# Altium project Sp25-Candle_Maker.PrjPcb (part 2 of 2)

## Sheet POWER_SHEET.SchDoc
size 381 x 241 mm; SheetNumber: 10; SheetTotal: 12
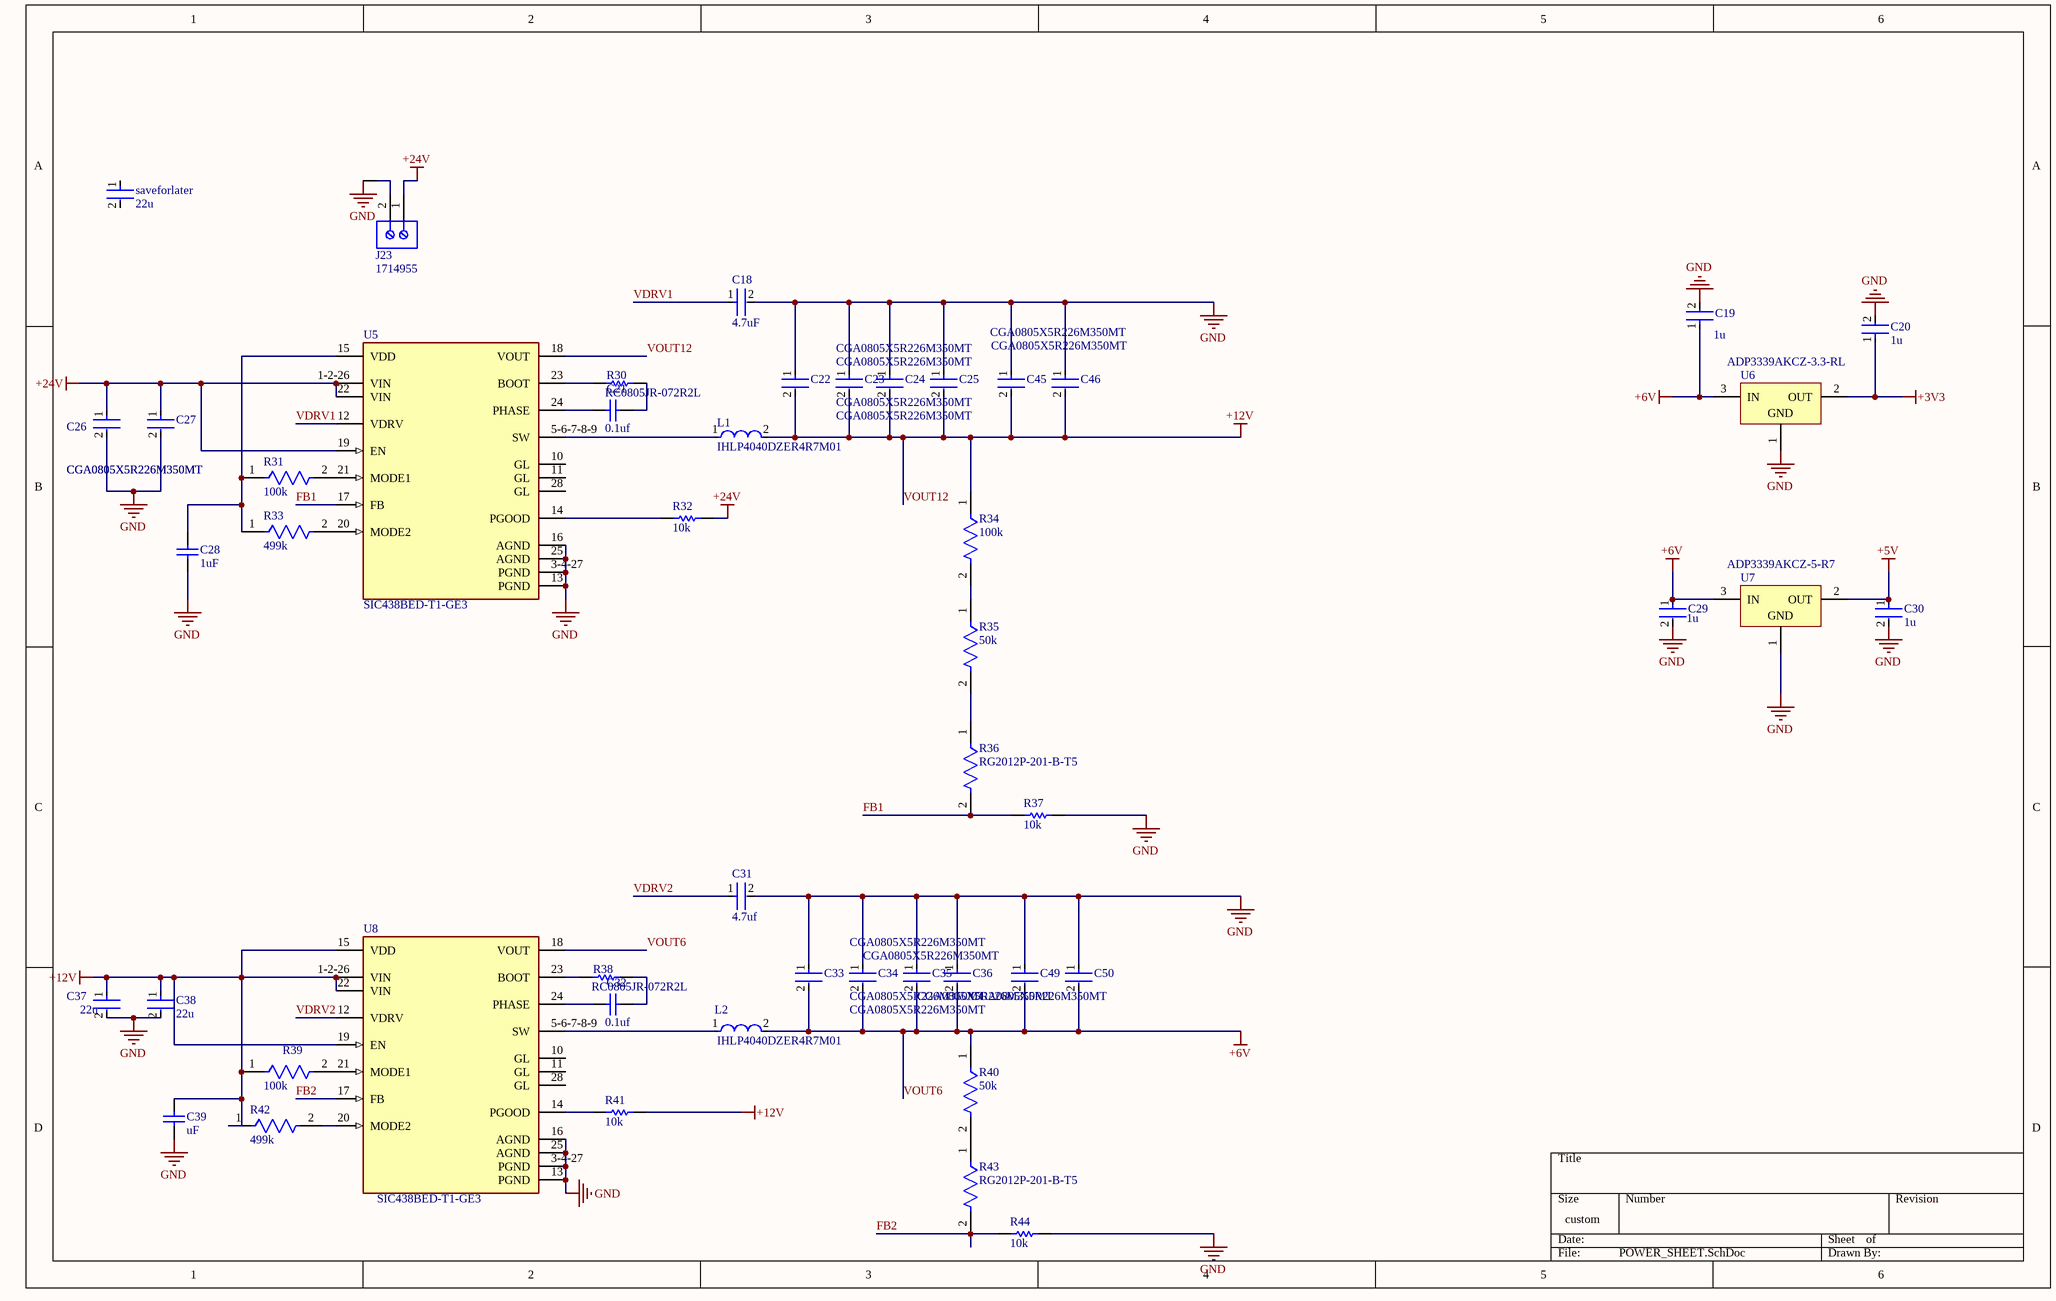
[diagram p6: POWER_SHEET.SchDoc]

### Parts
C18  4.7uF  [FP-CL21-IPC_A]
C19  1u  [FP-CL21-IPC_A]
C20  1u  [FP-CL21-IPC_A]
C21  0.1uf  [CAPC2013X94X50LL20T25]
C22  CGA0805X5R226M350MT  [FP-GRM21B-0_2-e0_2_0_7-IPC_A]
C23  CGA0805X5R226M350MT  [FP-GRM21B-0_2-e0_2_0_7-IPC_A]
C24  CGA0805X5R226M350MT  [FP-GRM21B-0_2-e0_2_0_7-IPC_A]
C25  CGA0805X5R226M350MT  [FP-GRM21B-0_2-e0_2_0_7-IPC_A]
C26  CGA0805X5R226M350MT  [FP-GRM21B-0_2-e0_2_0_7-IPC_A]
C27  CGA0805X5R226M350MT  [FP-GRM21B-0_2-e0_2_0_7-IPC_A]
C28  1uF  [CAPC2013X94X50ML25T25]
C29  1u  [FP-CL21-IPC_A]
C30  1u  [FP-CL21-IPC_A]
C31  4.7uf  [FP-CL21-IPC_A]
C32  0.1uf  [CAPC2013X94X50LL20T25]
C33  CGA0805X5R226M350MT  [FP-GRM21B-0_2-e0_2_0_7-IPC_A]
C34  CGA0805X5R226M350MT  [FP-GRM21B-0_2-e0_2_0_7-IPC_A]
C35  CGA0805X5R226M350MT  [FP-GRM21B-0_2-e0_2_0_7-IPC_A]
C36  CGA0805X5R226M350MT  [FP-GRM21B-0_2-e0_2_0_7-IPC_A]
C37  22u  [FP-CL21-IPC_C]
C38  22u  [FP-CL21-IPC_C]
C39  uF  [CAPC2013X94X50ML25T25]
C45  CGA0805X5R226M350MT  [FP-GRM21B-0_2-e0_2_0_7-IPC_A]
C46  CGA0805X5R226M350MT  [FP-GRM21B-0_2-e0_2_0_7-IPC_A]
C49  CGA0805X5R226M350MT  [FP-GRM21B-0_2-e0_2_0_7-IPC_A]
C50  CGA0805X5R226M350MT  [FP-GRM21B-0_2-e0_2_0_7-IPC_A]
J23  1714955  [PHOE-1714955_V]
L1  IHLP4040DZER4R7M01  [FP-IHLP-4040DZ-FP_3_124x3-MFG]
L2  IHLP4040DZER4R7M01  [FP-IHLP-4040DZ-FP_3_124x3-MFG]
R30  RC0805JR-072R2L  [RESC2013X60X35LL10T20]
R31  100k  [FP-ESR10-MFG]
R32  10k  [RESC2013X60X40LL20T25_A]
R33  499k  [FP-RT0805-MFG]
R34  100k  [FP-ESR10-MFG]
R35  50k  [FP-PNM0805-MFG]
R36  RG2012P-201-B-T5  [FP-RG2012-IPC_A]
R37  10k  [RESC2013X60X40LL20T25_A]
R38  RC0805JR-072R2L  [RESC2013X60X35LL10T20]
R39  100k  [FP-ESR10-MFG]
R40  50k  [FP-PNM0805-MFG]
R41  10k  [RESC2013X60X40LL20T25_A]
R42  499k  [FP-RT0805-MFG]
R43  RG2012P-201-B-T5  [FP-RG2012-IPC_A]
R44  10k  [RESC2013X60X40LL20T25_A]
saveforlater  22u  [FP-CL21-IPC_C]
U5  SIC438BED-T1-GE3  [FP-T22-0442-MFG]
U6  ADP3339AKCZ-3.3-RL  [ADI-KC-3_N]
U7  ADP3339AKCZ-5-R7  [ADI-KC-3_N]
U8  SIC438BED-T1-GE3  [FP-T22-0442-MFG]

### Nets
+3V3: C20.1 U6.2(OUT)
+5V: C30.1 U7.2(OUT)
+24V: C26.1 C27.1 J23.1 R32.2 U5.1-2-26(VIN) U5.19(EN) U5.22(VIN)
GND: C18.2 C19.2 C20.2 C22.1 C23.1 C24.1 C25.1 C26.2 C27.2 C28.1 C29.2 C30.2 C31.2 C33.1 C34.1 C35.1 C36.1 C37.2 C38.2 C39.1 C45.1 C46.1 C49.1 C50.1 J23.2 R37.2 R44.2 U5.3-4-27(PGND) U5.13(PGND) U5.16(AGND) U5.25(AGND) U6.1(GND) U7.1(GND) U8.3-4-27(PGND) U8.13(PGND) U8.16(AGND) U8.25(AGND)
VOUT6: C19.1 C29.1 C33.2 C34.2 C35.2 C36.2 C49.2 C50.2 L2.2 R40.1 U6.3(IN) U7.3(IN) U8.18(VOUT)  [also labelled +6V]
VOUT12: C22.2 C23.2 C24.2 C25.2 C37.1 C38.1 C39.2 C45.2 C46.2 L1.2 R34.1 R39.1 R41.2 R42.1 U5.18(VOUT) U8.1-2-26(VIN) U8.15(VDD) U8.19(EN) U8.22(VIN)  [also labelled +12V]
FB1: R36.2 R37.1 U5.17(FB)
FB2: R43.2 R44.1 U8.17(FB)
VDRV1: C18.1 U5.12(VDRV)
VDRV2: C31.1 U8.12(VDRV)
NetC21_1: C21.1 U5.24(PHASE)
NetC21_2: C21.2 R30.2
NetC28_2: C28.2 R31.1 R33.1 U5.15(VDD)
NetC32_1: C32.1 U8.24(PHASE)
NetC32_2: C32.2 R38.2
NetL1_1: L1.1 U5.5-6-7-8-9(SW)
NetL2_1: L2.1 U8.5-6-7-8-9(SW)
NetR30_1: R30.1 U5.23(BOOT)
NetR31_2: R31.2 U5.21(MODE1)
NetR32_1: R32.1 U5.14(PGOOD)
NetR33_2: R33.2 U5.20(MODE2)
NetR34_2: R34.2 R35.1
NetR35_2: R35.2 R36.1
NetR38_1: R38.1 U8.23(BOOT)
NetR39_2: R39.2 U8.21(MODE1)
NetR40_2: R40.2 R43.1
NetR41_1: R41.1 U8.14(PGOOD)
NetR42_2: R42.2 U8.20(MODE2)

Not connected (* = marked no-connect by the designer): saveforlater 1 2; U5 10(GL) 11(GL) 28(GL); U8 10(GL) 11(GL) 28(GL)

### Library data of the parts
C18 C31 = CMP-13271-002624-1: CL21 Series 0805 4.7uF 25V ±10% Tolerance X5R Multilayer Ceramic Chip Capacitor; Case Code (Imperial): 0805; Thickness: 0.055inch; Mount: Surface Mount; Case Code (Metric): 2012; Capacitance: 4.7uF; Depth: 1.25mm; Lead Free: Lead Free; Case/Package: 0805; Voltage Rating: 25V; Package Quantity: 1; Width: 0.049inch; Radiation Hardening: No; Voltage Rating (DC): 25V; Length: 2mm; Dielectric: X5R; Height: 1.25mm; Packaging: Tape and Reel; Tolerance: 10%; Min Operating Temperature: -55°C; Max Operating Temperature: 85°C
C19 C20 C29 C30 = CMP-13271-003098-1: CL21 Series 0805 1uF 16V ±10% Tolerance X7R Multilayer Ceramic Chip Capacitor; Case Code (Metric): 2012; Width: 0.049inch; Thickness: 0.053inch; Voltage Rating: 16V; Max Operating Temperature: 125°C; Case Code (Imperial): 0805; Height: 1.25mm; Length: 2mm; Case/Package: 0805; Lead Free: Lead Free; Mount: Surface Mount; Capacitance: 1uF; Tolerance: 10%; Voltage Rating (DC): 16V; Min Operating Temperature: -55°C; Contact Plating: Tin; Depth: 1.25mm; Packaging: Tape and Reel; Package Quantity: 1; Voltage: 16V; Dielectric: X7R; Radiation Hardening: No
C21 C32 = CMP-2007-04344-1: Manufacturer: AVX Interconnect / Elco; Part Number: 08055A6R0CAT2A
C22-C27 C33-C36 C45 C46 C49 C50 = CMP-2000-07599-2: Chip Multilayer Ceramic Capacitors for General Purpose, 0805, 100uF, X5R, 15%, 20%, 6.3V; Length: 0.079inch; Dielectric: X5R; Case Code (Metric): 2012; Max Operating Temperature: 85°C; Voltage Rating (DC): 6.3V; Min Operating Temperature: -55°C; Tolerance: 20%; Packaging: Cut Tape; Voltage Rating: 6.3V; Capacitance: 100uF; REACH SVHC: No SVHC; Width: 0.049inch; Mount: Surface Mount; Case/Package: 0805; Case Code (Imperial): 0805; Lead Free: Lead Free; Thickness: 0.057inch
C28 C39 = CMP-2007-04103-1: Manufacturer: AVX Interconnect / Elco; Part Number: LD055C224KAB2A
C37 C38 saveforlater = CMP-13271-003225-1: CL21 Series 0805 22uF 25V ±20% Tolerance X5R Multilayer Ceramic Chip Capacitor
J23 = CMP-2000-05797-1: PC Terminal Block, Pitch 6.35 mm, 1 x 2 Position, Height 21.5 mm, Tail Lenght 5.1 mm, RoHS, Bulk; Manufacturer: Phoenix Contact; Package Description: PC Terminal Block, Pitch 6.35 mm, 1 x 2 Position, Height 21.5 mm, Tail Lenght 5.1 mm; Datasheet URL: http://media.digikey.com/pdf/Data%20Sheets/Phoenix%20Contact%20PDFs/1714955.pdf; Package Reference: 1714955; Manufacturer URL: http://www.phoenixcontact.com/; Datasheet Version: 02/2010; Mounting Technology: ThroughHole
L1 L2 = CMP-02424-000650-1: Commercial Inductors, High Saturation Series 4.7uH 9.5A 16.5mΩ 20%; Shielding: Shielded; DC Resistance (DCR): 16.5mR; Core Material: Metal; Self Resonant Frequency: 5MHz; Test Frequency: 100kHz; Saturation Current: 17A; Min Operating Temperature: -55°C; Max DC Current: 9.5A; RMS Current (Irms): 9.5A; Inductance Tolerance: 20%; Contact Plating: Tin; Tolerance: 20%; Radiation Hardening: No; Length: 0.43inch; Width: 10.3mm; Current Rating: 9.5A; Package Quantity: 500; Mount: Surface Mount; Military Standard: Not; Termination: SMD/SMT; Max Operating Temperature: 125°C; Packaging: Tape and Reel; Lead Free: Lead Free; Height - Seated (Max): 0.157inch; Height: 4mm; Depth: 10.3mm; Case/Package: 4040; Inductance: 4.7uH
R30 R38 = CMP-2001-01364-1: Manufacturer: Yageo; Part Number: RC0805JR-072R2L
R31 R34 R39 = CMP-08839-029189-1: 100kΩ ±5% 0.4W 0805 Anti-Surge Chip Resistor AEC-Q200; Max Power Dissipation: 400mW; Resistance: 100kR; Temperature Coefficient: 200ppm/°C; Features: Automotive AEC-Q200; Packaging: Tape and Reel; Case/Package: 0805; RoHS Compliant: Yes; Min Operating Temperature: -55°C; Tolerance: 5%; Resistor Type: Thick Film; Series: ESR; Max Operating Temperature: 155°C; Case Code (Imperial): 0805; Number of Terminations: 2; Contact Plating: Tin; Case Code (Metric): 2012
R32 R37 R41 R44 = CMP-2001-00582-2: Metal Film Chip Resistor, High Reliability Type, 0.125 W, +/- 0.1%, -55 to 155 degC, 0805 (2012 Metric), RoHS, Tape and Reel; Voltage Rating: 100V; Power Rating: 125mW(1/8W); Brand: Panasonic; Temperature Coefficient: 25PPM/C; Resistance: 10kOhms; Product Category: ThinFilmResistors-SMD; Datasheet Version: 02/2016; Operating Temperature Range: -55Cto+155C; Length: 2mm; Mounting Technology: SurfaceMount; Manufacturer URL: http://www.panasonic.com/; Width: 1.25mm; Packaging: Reel; Product: ThinFilmResistorsSMD; Package / Case: 0805(2012metric); Termination Style: SMD/SMT; Tolerance: 0.1%; Datasheet URL: https://industrial.panasonic.com/cdbs/www-data/pdf/RDM0000/AOA0000C307.pdf; Package Description: 2-Pin Surface Mount Device, Body 2 x 1.25 mm; Factory Pack Quantity: 5000; Series: ERA-6A; Case Code - mm: 2012; RoHS: Details; Package Reference: 0805; Height: 0.5mm; Manufacturer: Panasonic; Case Code - in: 0805; Type: MetalFilmChipResistors
R33 R42 = CMP-03412-000931-1: RES SMD 332K OHM 1% 1/8W 0805; Manufacturer: Yageo; Manufacturer Part Number: RT0805FRE07332KL; Voltage Rating: 150V; Temperature Coefficient: 50 ppm/°C; Value: 332KΩ; Power Rating: 0.125W; Tolerance: 0.0001; Category: Res; RoHS: TRUE; Footprint Url: http://www.yageo.com/exep/pages/download/literatures/PYu-R_Mount_10.pdf; Ipc Land Pattern Name: RESC200125X50; Composition: Thin Film; Device Class L2: Resistors; ComponentLink2URL: http://www.yageo.com/documents/recent/PYu-RT_1-to-0.01_RoHS_L_9.pdf; Device Class L3: Chip SMD Resistors; Device Class L1: Passive Components; Digikey Description: RES SMD 332K OHM 1% 1/8W 0805; Height: 0.6mm; ComponentLink2Description: Datasheet; Automotive: No; Resistance: 332KΩ; Octopart: https://octopart.com/rt0805fre07332kl-yageo-1277672; Temperature Range Low: -55°C; Temperature: -55°C to +155°C; Mouser Description: Thin Film Resistors - SMD 1/8W 332K ohm 1% 50ppm; Temperature Range High: +155°C; Package: RT0805; Series: RT; Lead Free: Yes
R35 R40 = CMP-02407-012955-1: RES SMD 50K OHM 0.1% 1/5W 0805; Power Rating: 200mW; Resistance: 50kR; Temperature Coefficient: 25ppm/°C; Voltage Rating (DC): 100V; Features: Moisture Resistant; Case/Package: 0805; Resistance Tolerance: 0.1%; Max Power Dissipation: 200mW; Length: 0.08inch; Case Code (Imperial): 0805; Tolerance: 0.1%; Height: 0.015inch; Termination: SMD/SMT; Packaging: Tape and Reel; Max Operating Temperature: 155°C; Case Code (Metric): 2012; Min Operating Temperature: -55°C; Number of Terminations: 2; Width: 0.05inch; Resistor Type: Thin Film; Series: PNM; RoHS Compliant: Yes; Voltage Rating: 100V
R36 R43 = CMP-2001-02821-2: Automotive Metal Thin Film Chip Resistor, 0805, 200Ω, 0.1%, 25ppm/°C, 0.125W, 150V; Voltage Rating: 100V; Resistance: 200R; Max Power Dissipation: 125mW; Power Rating: 100mW; Voltage Rating (DC): 150V; Termination: SMD/SMT; Size Code: 0805; Tolerance: 0.1%; Length: 2mm; Width: 1.25mm; Case Code (Metric): 2012; Package Quantity: 5000; Temperature Coefficient: 25ppm/°C; Case/Package: 0805; Packaging: Tape and Reel; Max Operating Temperature: 155°C; Lead Free: Lead Free; RoHS Compliant: Yes; Height: 0.4mm; Series: RG; Case Code (Imperial): 0805; Number of Terminations: 2; Min Operating Temperature: -55°C; Features: Automotive AEC-Q200
U5 U8 = CMP-00030-87948109-1: SIC438BED-T1-GE3 Synchronous Buck Regulator Power Saving 28V I/P Adjustable O/P 8A 24-Pin PowerPAK MLP44 T/R; Output Voltage: 20V; NexarPartId: 87948109; RoHS: Non-Compliant; Schedule B: 8542390000; Output Current: 8A
U6 = CMP-0786-00155-1: High Accuracy, Ultralow IQ, 1.5 A, anyCAP Low Dropout Regulator, 2.8 to 6 V Vin, 3.3 V Vout, Industrial, 3-pin SOT223 (KC-3), Reel; Manufacturer: Analog Devices; Preset Vout Values (V): 3.3; Vin (max) (V): 6; Iout max: 1.5A; Vin (min) (V): 2.8; Supply Current IGND @ Small Load: 130uA; PackageDescription: 3-Pin Small Outline Transistor Package, Body 3.5 x 6.5 mm, Pitch 2.3 mm; ComponentLink2Description: Datasheet; PackageReference: KC-3; ComponentLink4URL: Product URL:http://www.analog.com/en/ADP3339/productSearch.html; ComponentLink2URL: http://www.analog.com/static/imported-files/data_sheets/ADP3339.pdf; ComponentLink3URL: http:/www.analog.com/static/imported-files/packages/PKG_PDF/SOT_223(KC)/KC_3.pdf; Mounting Technology: Surface Mount; Code_JEDEC: TO-261-AA; ComponentLink1URL: http://www.analog.com/en/index.html; PartNumber: ADP3339AKCZ-3.3-RL; ComponentLink3Description: Package Specification; ComponentLink1Description: Manufacturer URL; PackageVersion: 11-20-2012-B, 11/2012; DatasheetVersion: Rev. C; ComponentLink4Description: URL Link1; Packing: Reel
U7 = CMP-0786-00154-1: High Accuracy, Ultralow IQ, 1.5 A, anyCAP Low Dropout Regulator, 2.8 to 6 V Vin, 5 V Vout, Industrial, 3-pin SOT223 (KC-3), Reel; Manufacturer: Analog Devices; Iout max: 1.5A; Supply Current IGND @ Small Load: 130uA; Vin (max) (V): 6; Preset Vout Values (V): 5.0; Vin (min) (V): 2.8; ComponentLink2Description: Datasheet; DatasheetVersion: Rev. C; Packing: Reel; ComponentLink1URL: http://www.analog.com/en/index.html; PackageVersion: 11-20-2012-B, 11/2012; ComponentLink4Description: URL Link1; Code_JEDEC: TO-261-AA; Mounting Technology: Surface Mount; ComponentLink1Description: Manufacturer URL; ComponentLink3Description: Package Specification; PackageDescription: 3-Pin Small Outline Transistor Package, Body 3.5 x 6.5 mm, Pitch 2.3 mm; ComponentLink4URL: Product URL:http://www.analog.com/en/ADP3339/productSearch.html; ComponentLink2URL: http://www.analog.com/static/imported-files/data_sheets/ADP3339.pdf; PackageReference: KC-3; PartNumber: ADP3339AKCZ-5-R7; ComponentLink3URL: http:/www.analog.com/static/imported-files/packages/PKG_PDF/SOT_223(KC)/KC_3.pdf

## Sheet UI.SchDoc
size A; SheetNumber: 2; SheetTotal: 12
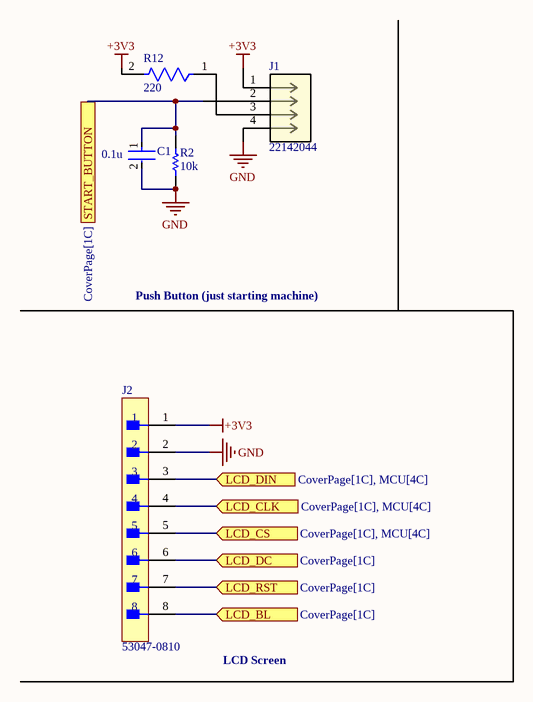
[diagram p7: UI.SchDoc]

### Parts
C1  0.1u  [FP-CL21-IPC_A]
J1  22142044  [CONN_SDA-4455_04_BE_MOL]
J2  53047-0810  [53047-0810_MFG]
R2  10k  [RESC2013X60X40LL20T25_A]
R12  220  [FP-CRCW0805-e3-MFG]

### Ports
LCD_BL (in, see CoverPage[1C]), LCD_CLK (in, see CoverPage[1C], MCU[4C]), LCD_CS (in, see CoverPage[1C], MCU[4C]), LCD_DC (in, see CoverPage[1C]), LCD_DIN (in, see CoverPage[1C], MCU[4C]), LCD_RST (in, see CoverPage[1C]), START_BUTTON (see CoverPage[1C])

### Nets
+3V3: J1.1 J2.1 R12.2
GND: C1.2 J1.4 J2.2 R2.1
LCD_BL: J2.8 ; port LCD_BL
LCD_CLK: J2.4 ; port LCD_CLK
LCD_CS: J2.5 ; port LCD_CS
LCD_DC: J2.6 ; port LCD_DC
LCD_DIN: J2.3 ; port LCD_DIN
LCD_RST: J2.7 ; port LCD_RST
START_BUTTON: C1.1 J1.2 R2.2 ; port START_BUTTON
NetJ1_3: J1.3 R12.1

### Notes on the sheet
- Push Button (just starting machine)
- LCD Screen

### Library data of the parts
C1 = CMP-13271-000411-1: CL21 Series 0805 100nF 100V ±10% Tolerance X7R Multilayer Ceramic Chip Capacitor
J1 = CMP-129-000000-1: No Description Available; Mfr_Name: Molex Connector Corporation; Design Item ID: 22142044; Type: Type; RefDes: RefDes; Source: 22142044.SchLib
J2 = CMP-00257-00276778-1: Conn Shrouded Header (4 Sides) HDR 8 POS 1.25mm Solder ST Top Entry Thru-Hole PicoBlade Tray; Manufacturer Lifecycle Status: ACTIVE; Gender: Male; Glow Wire Compliant: Non-compliant; Current Rating: 1A; Number of Positions: 8; Contact Resistance: 20mΩ; Insulation Resistance: 100MΩ; Plating: Tin; Voltage Rating (DC): 125V; Number of Circuits: 7; Schedule B: 8536694040, 8536694040; Max Operating Temperature: 85°C; Housing Material: Polyamide; Pitch: 1.25mm; Number of Rows: 1; ComponentLink1URL: http://molex.com; Country of Origin: MX; Case/Package: 0810; Height: 4.4mm; Housing Color: Natural; Flammability Rating: UL94 V-0; Orientation: Vertical; ComponentLink3Description: Manufacturer's Package Drawing; Mount: Through Hole; Min Operating Temperature: -40°C; Number of Pins: 8; Radiation Hardening: No; Contact Plating: Tin; Lead Pitch: 1.25mm; China RoHS: Compliant; ComponentLink1Description: Manufacturer's Website; Lead Free: Lead Free; ComponentLink2Description: Datasheet URL; RoHS: Compliant; Voltage Rating (AC): 125V; ComponentLink3URL: https://www.molex.com/content/dam/molex/molex-dot-com/products/automated/en-us/salesdrawingpdf/530/53047/530470810_sd.pdf?inline; Color: Natural; Number of Contacts: 8; Lifecycle Status: Production; HelpURL: https://www.molex.com/en-us/products/part-detail/530470810#part-details; ComponentLink2URL: https://www.molex.com/en-us/products/part-detail/530470810#part-details; REACH SVHC: Unknown; Contact Material: Tin; Termination: Through Hole; Voltage Rating: 125V
R2 = CMP-2001-00582-2: as R32 on sheet POWER_SHEET; Product Category: ThinFilmResistors-SMD; Datasheet Version: 02/2016; Operating Temperature Range: -55Cto+155C; Length: 2mm; Mounting Technology: SurfaceMount; Manufacturer URL: http://www.panasonic.com/; Width: 1.25mm; Packaging: Reel; Product: ThinFilmResistorsSMD; Package / Case: 0805(2012metric); Termination Style: SMD/SMT; Tolerance: 0.1%; Datasheet URL: https://industrial.panasonic.com/cdbs/www-data/pdf/RDM0000/AOA0000C307.pdf; Package Description: 2-Pin Surface Mount Device, Body 2 x 1.25 mm; Factory Pack Quantity: 5000; Series: ERA-6A; Case Code - mm: 2012; RoHS: Details; Package Reference: 0805; Height: 0.5mm; Manufacturer: Panasonic; Case Code - in: 0805; Type: MetalFilmChipResistors
R12 = CMP-2001-03823-2: RES Thick Film, 330Ω, 1%, 0.125W, 100ppm/°C, 0805; Voltage Rating (DC): 150V; Resistance: 330R; Max Power Dissipation: 125mW; Mount: Surface Mount; Packaging: Tape and Reel; Min Operating Temperature: -55°C; Military Standard: Not; Case Code (Metric): 2012; Height: 0.02inch; Voltage Rating: 150V; Case/Package: 0805; Max Operating Temperature: 155°C; Width: 0.049inch; Case Code (Imperial): 0805; Termination: SMD/SMT; Lead Free: Lead Free; Contact Plating: Tin; Package Quantity: 10; Composition: Thick Film; Length: 2mm; Features: Automotive AEC-Q200; Depth: 1.25mm; Weight: 0.000194oz; Tolerance: 1%; Power Rating: 125mW; Number of Terminations: 2; Temperature Coefficient: 100ppm/°C

## Sheet GPIO_EXPANDER_A.SchDoc
size A; SheetNumber: 8; SheetTotal: 12
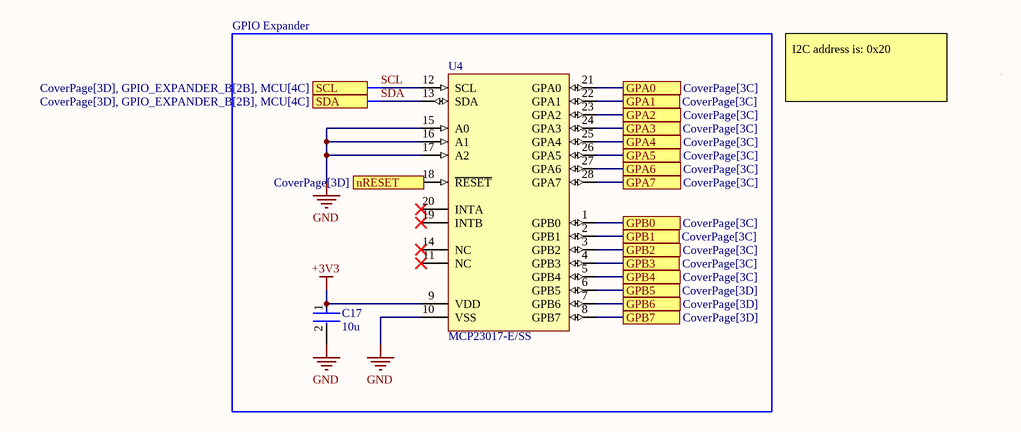
[diagram p8: GPIO_EXPANDER_A.SchDoc]

### Parts
C17  10u  [FP-C0805C-DG-MFG]
U4  MCP23017-E/SS  [SSOP-SS28_N]

### Ports
GPA0 (see CoverPage[3C]), GPA1 (see CoverPage[3C]), GPA2 (see CoverPage[3C]), GPA3 (see CoverPage[3C]), GPA4 (see CoverPage[3C]), GPA5 (see CoverPage[3C]), GPA6 (see CoverPage[3C]), GPA7 (see CoverPage[3C]), GPB0 (see CoverPage[3C]), GPB1 (see CoverPage[3C]), GPB2 (see CoverPage[3C]), GPB3 (see CoverPage[3C]), GPB4 (see CoverPage[3C]), GPB5 (see CoverPage[3D]), GPB6 (see CoverPage[3D]), GPB7 (see CoverPage[3D]), nRESET (in, see CoverPage[3D]), SCL (see CoverPage[3D], GPIO_EXPANDER_B[2B], MCU[4C]), SDA (see CoverPage[3D], GPIO_EXPANDER_B[2B], MCU[4C])

### Nets
+3V3: C17.1 U4.9(VDD)
GND: C17.2 U4.10(VSS) U4.15(A0) U4.16(A1) U4.17(A2)
ENCA_DIS: U4.23(GPA2) ; port GPA2
ENCA_EJ: U4.2(GPB1) ; port GPB1
ENCA_RS: U4.5(GPB4) ; port GPB4
ENCA_WCK: U4.27(GPA6) ; port GPA6
ENCB_DIS: U4.24(GPA3) ; port GPA3
ENCB_EJ: U4.1(GPB0) ; port GPB0
ENCB_RS: U4.6(GPB5) ; port GPB5
ENCB_WCK: U4.28(GPA7) ; port GPA7
INA_DIS: U4.22(GPA1) ; port GPA1
INA_EJ: U4.3(GPB2) ; port GPB2
INA_RS: U4.8(GPB7) ; port GPB7
INA_WCK: U4.25(GPA4) ; port GPA4
INB_DIS: U4.21(GPA0) ; port GPA0
INB_EJ: U4.4(GPB3) ; port GPB3
INB_RS: U4.7(GPB6) ; port GPB6
INB_WCK: U4.26(GPA5) ; port GPA5
SCL: U4.12(SCL) ; port SCL
SDA: U4.13(SDA) ; port SDA

Not connected (* = marked no-connect by the designer): U4 11(NC)* 14(NC)* 18(~{RESET}) 19(INTB)* 20(INTA)*

### Notes on the sheet
- GPIO Expander
- I2C address is: 0x20
- Type @ to refer to a designator or a net

### Library data of the parts
C17 = CMP-2007-03243-2: CAP CER 10UF 10V X5R 0805; Manufacturer Part Number: C0805C106K8PACTU; Manufacturer: Kemet; 3DS Part Number: 220-00001; Tolerance: 10%; Temperature Coefficient: 15%; Material: Ceramic; Device Class L2: Capacitors; Device Class L1: Passive Components; ComponentLink2URL: https://content.kemet.com/datasheets/KEM_C1006_X5R_SMD.pdf; Height: 1.4mm; Lead Free: Yes; Digikey Description: CAP CER 10UF 10V X5R 0805; Octopart: https://octopart.com/c0805c106k8pactu-kemet-98697; Capacitance: 10uF; Value: 10uF; Temperature Range Low: -55°C; Temperature: -55°C to +85°C; Automotive: No; Mouser Description: CAP CER 10UF 10V X5R 0805; Ipc Land Pattern Name: CAPC200125X125; Temperature Range High: +85°C; Voltage: 10V; RoHS: TRUE; Device Class L3: Ceramic Capacitors; ComponentLink2Description: Datasheet; Voltage Rating: 10V; Package: C0805C-DG; Temperature Characteristic: X5R; Category: Cap
U4 = CMP-0186-00176-2: 16-Bit I/O Expander with Serial Interface, 28-Pin SSOP, Extended Temperature; PackageVersion: revBB, Aug-2009; ComponentLink1Description: Manufacturer URL; ComponentLink3Description: Package Specification; PackageDescription: 28-Lead Plastic Shrink Small Outline (SS) - 5.3mm Body [SSOP]; ComponentLink1URL: http://www.microchip.com/; Code_JEDEC: MS-150; RevisionNote: URLs added.; ComponentLink3URL: http://www.microchip.com/stellent/groups/techpub_sg/documents/packagingspec/en012702.pdf; ComponentLink2URL: http://ww1.microchip.com/downloads/en/DeviceDoc/21952b.pdf; ComponentLink2Description: Datasheet; PackageReference: SSOP-SS28; DatasheetVersion: revB, Feb-2007

## Sheet GPIO_EXPANDER_B.SchDoc
size A; SheetNumber: 9; SheetTotal: 12
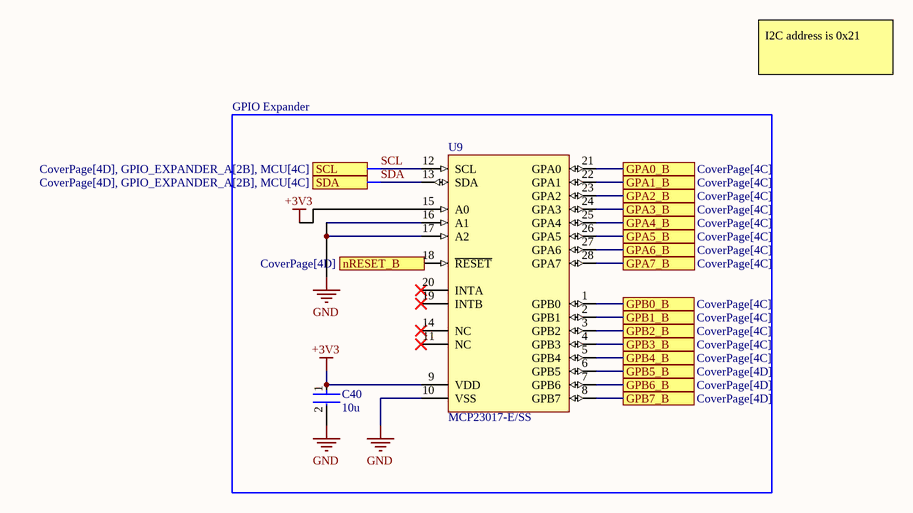
[diagram p9: GPIO_EXPANDER_B.SchDoc]

### Parts
C40  10u  [FP-C0805C-DG-MFG]
U9  MCP23017-E/SS  [SSOP-SS28_N]

### Ports
GPA0_B (see CoverPage[4C]), GPA1_B (see CoverPage[4C]), GPA2_B (see CoverPage[4C]), GPA3_B (see CoverPage[4C]), GPA4_B (see CoverPage[4C]), GPA5_B (see CoverPage[4C]), GPA6_B (see CoverPage[4C]), GPA7_B (see CoverPage[4C]), GPB0_B (see CoverPage[4C]), GPB1_B (see CoverPage[4C]), GPB2_B (see CoverPage[4C]), GPB3_B (see CoverPage[4C]), GPB4_B (see CoverPage[4C]), GPB5_B (see CoverPage[4D]), GPB6_B (see CoverPage[4D]), GPB7_B (see CoverPage[4D]), nRESET_B (in, see CoverPage[4D]), SCL (see CoverPage[4D], GPIO_EXPANDER_A[2B], MCU[4C]), SDA (see CoverPage[4D], GPIO_EXPANDER_A[2B], MCU[4C])

### Nets
+3V3: C40.1 U9.9(VDD) U9.15(A0)
GND: C40.2 U9.10(VSS) U9.16(A1) U9.17(A2)
INA_MIX: U9.26(GPA5) ; port GPA5_B
INB_MIX: U9.25(GPA4) ; port GPA4_B
LS_DIS: U9.24(GPA3) ; port GPA3_B
LS_EJ: U9.22(GPA1) ; port GPA1_B
LS_RS: U9.21(GPA0) ; port GPA0_B
LS_WCK: U9.23(GPA2) ; port GPA2_B
SCL: U9.12(SCL) ; port SCL
SDA: U9.13(SDA) ; port SDA
NetU9_1: U9.1(GPB0) ; port GPB0_B
NetU9_2: U9.2(GPB1) ; port GPB1_B
NetU9_3: U9.3(GPB2) ; port GPB2_B
NetU9_4: U9.4(GPB3) ; port GPB3_B
NetU9_5: U9.5(GPB4) ; port GPB4_B
NetU9_6: U9.6(GPB5) ; port GPB5_B
NetU9_7: U9.7(GPB6) ; port GPB6_B
NetU9_8: U9.8(GPB7) ; port GPB7_B
NetU9_27: U9.27(GPA6) ; port GPA6_B
NetU9_28: U9.28(GPA7) ; port GPA7_B

Not connected (* = marked no-connect by the designer): U9 11(NC)* 14(NC)* 18(~{RESET}) 19(INTB)* 20(INTA)*

### Notes on the sheet
- GPIO Expander
- I2C address is 0x21

### Library data of the parts
C40 = CMP-2007-03243-2: as C17 on sheet GPIO_EXPANDER_A; Device Class L2: Capacitors; Device Class L1: Passive Components; ComponentLink2URL: https://content.kemet.com/datasheets/KEM_C1006_X5R_SMD.pdf; Height: 1.4mm; Lead Free: Yes; Digikey Description: CAP CER 10UF 10V X5R 0805; Octopart: https://octopart.com/c0805c106k8pactu-kemet-98697; Capacitance: 10uF; Value: 10uF; Temperature Range Low: -55°C; Temperature: -55°C to +85°C; Automotive: No; Mouser Description: CAP CER 10UF 10V X5R 0805; Ipc Land Pattern Name: CAPC200125X125; Temperature Range High: +85°C; Voltage: 10V; RoHS: TRUE; Device Class L3: Ceramic Capacitors; ComponentLink2Description: Datasheet; Voltage Rating: 10V; Package: C0805C-DG; Temperature Characteristic: X5R; Category: Cap
U9 = CMP-0186-00176-2: as U4 on sheet GPIO_EXPANDER_A; PackageVersion: revBB, Aug-2009; ComponentLink1Description: Manufacturer URL; ComponentLink3Description: Package Specification; PackageDescription: 28-Lead Plastic Shrink Small Outline (SS) - 5.3mm Body [SSOP]; ComponentLink1URL: http://www.microchip.com/; Code_JEDEC: MS-150; RevisionNote: URLs added.; ComponentLink3URL: http://www.microchip.com/stellent/groups/techpub_sg/documents/packagingspec/en012702.pdf; ComponentLink2URL: http://ww1.microchip.com/downloads/en/DeviceDoc/21952b.pdf; ComponentLink2Description: Datasheet; PackageReference: SSOP-SS28; DatasheetVersion: revB, Feb-2007

## Sheet SOLENOID.SchDoc
size A; SheetNumber: 10; SheetTotal: 11
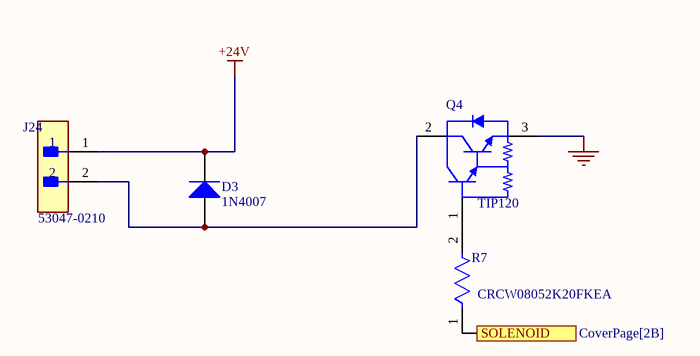
[diagram p10: SOLENOID.SchDoc]

### Parts
D3  1N4007  [FAIR-DO-41-2]
J24  53047-0210  [FP-53047-0210-MFG]
Q4  TIP120  [ONSC-TO-220-3-221A-09]
R7  CRCW08052K20FKEA  [FP-CRCW0805-e3-IPC_B]

### Ports
SOLENOID (see CoverPage[2B])

### Nets
+24V: D3.1(K) J24.1
GND: Q4.3(E)
SOLENOID: R7.1 ; port SOLENOID
NetD3_2: D3.2(A) J24.2 Q4.2(C)
NetQ4_1: Q4.1(B) R7.2

### Library data of the parts
D3 = CMP-004-00007-2: General Purpose Rectifier, 1.1 V, 1.0 A, -55 to 175 degC, 2-Pin DO-41, RoHS, Tape and Reel; Manufacturer: Fairchild; Peak Reverse Current: 5uA; Max Surge Current: 30A; Elements: 1; Forward Voltage: 1.1V; Package Version: Rev. 2, 09/2008; Forward Current: 1A; Package Quantity: 5000; Packaging: TapeandReel; Package URL: http://www.fairchildsemi.com/dwg/DO/DO41A.pdf; Manufacturer URL: https://www.fairchildsemi.com/; Package Reference: DO-41-2; Pins: 2; Min Operating Temperature: -55°C; Datasheet Version: Rev. 1.1.0, 11/2014; Max Operating Temperature: 175°C; RoHS Compliant: True; Case/Package: DO-41-2; Mounting Technology: TH; Package Description: 2-Pin Axial Lead, Dia 2.375 mm, Body Length 4.63 mm; Datasheet URL: https://www.fairchildsemi.com/datasheets/1N/1N4007.pdf
J24 = CMP-2000-05628-3: CONN HEADER VERT 2POS 1.25MM; Manufacturer: Molex; Conn Gender: Male; Voltage Rating: 125V; Conn Orientation: Vertical; Number Of Contacts: 2; Current Rating: 1A; Contact Material: Tin; Temperature Range Low: -40°C; ComponentLink2URL: http://www.molex.com/webdocs/datasheets/pdf/en-us/0530470210_PCB_HEADERS.pdf; Mouser Description: 1.25mm Pitch PicoBlade™ Wire-to-Board Header, Vertical, with Friction Lock, 2 Circuits; Manufacturer Part Number: 53047-0210; Temperature Range High: +85°C; ComponentLink2Description: Datasheet; Automotive: No; RoHS: TRUE; Ambient Temperature Range High: +85°C; Octopart: https://octopart.com/53047-0210-molex-276772; Footprint Url: https://www.molex.com/pdm_docs/sd/530470210_sd.pdf; Lead Free: Yes; Pitch: 1.25mm; Temperature: -40°C to +85°C; Device Class L2: Headers and Wire Housings; Package: 0; Ambient Temperature Range Low: -40°C; Digikey Description: CONN HEADER VERT 2POS 1.25MM; Category: Conn; Device Class L3: unset; Number Of Rows: 1; Device Class L1: Connectors; Height: 4.4mm
Q4 = CMP-013-00001-3: Plastic Medium-Power Complementary Silicon Transistor, 60 V VCEO, -65 to 150 degC, 3-Pin TO-220, RoHS, Tube; Manufacturer: ON Semiconductor; hFE Min: 1000; Package Version: Rev. AH, 08/2014; Vce Max: 4V; Package Quantity: 50; Pins: 3; Min Operating Temperature: -65°C; Datasheet Version: Rev. 9, 11/2014; Mounting Technology: TH; Package Description: 3-Pin Flange Mount, Vertical Straight Lead, Body 10.095 x 4.45 mm, Pitch 2.54 mm; Case/Package: TO-220-3; RoHS Compliant: True; Datasheet URL: http://www.onsemi.cn/pub_link/Collateral/TIP120-D.PDF; Packaging: Rail/Tube; Max Operating Temperature: 150°C; Package Reference: TO-220-3-221A-09
R7 = CMP-2001-03760-2: RES Thick Film, 2.2kΩ, 1%, 0.125W, 100ppm/°C, 0805; Voltage Rating (DC): 150V; Max Power Dissipation: 125mW; Resistance: 2.2kR; Case/Package: 0805; Width: 1.25mm; Voltage Rating: 150V; Composition: Thick Film; Power Rating: 125mW; Packaging: Tape and Reel; Min Operating Temperature: -55°C; Contact Plating: Tin; Tolerance: 1%; Military Standard: Not; Case Code (Metric): 2012; Radiation Hardening: No; Termination: SMD/SMT; Lead Free: Lead Free; Case Code (Imperial): 0805; Max Operating Temperature: 155°C; Depth: 1.25mm; Weight: 0.000194oz; Number of Terminations: 2; Length: 2mm; Package Quantity: 10; Temperature Coefficient: 100ppm/°C; Features: Automotive AEC-Q200; Height: 0.45mm

## Sheet LDO.SchDoc
size A; SheetNumber: 12; SheetTotal: 12

## Nets that join several sheets
+3V3: CoverPage (J30.1), HEATING (U1.1 U1.5), MCU (15 pins), Designator/D1 (R19_D1.2 R20_D1.2), Designator/D5 (R19_D5.2 R20_D5.2), Designator/D4 (R19_D4.2 R20_D4.2), Designator/D2 (R19_D2.2 R20_D2.2), Designator/D3 (R19_D3.2 R20_D3.2), POWER_SHEET (C20.1 U6.2), UI (J1.1 J2.1 R12.2), GPIO_EXPANDER_A (C17.1 U4.9), GPIO_EXPANDER_B (C40.1 U9.9 U9.15)
+5V: CoverPage (J31.1), HEATING (R3.1 U1.6), COOLING (R17.1), POWER_SHEET (C30.1 U7.2)
+24V: CoverPage (J34.1), HEATING (10 pins), POWER_SHEET (7 pins), SOLENOID (D3.1 J24.1)
GND: CoverPage (J29.1), HEATING (J3.2 Q1.3 U1.2), MCU (27 pins), MOTORS (8 pins), Designator/D1 (11 pins), Designator/D5 (11 pins), Designator/D4 (11 pins), Designator/D2 (11 pins), Designator/D3 (11 pins), COOLING (J13.2 J25.2 J26.2), POWER_SHEET (37 pins), UI (C1.2 J1.4 J2.2 R2.1), GPIO_EXPANDER_A (5 pins), GPIO_EXPANDER_B (C40.2 U9.10 U9.16 U9.17), SOLENOID (Q4.3)
VOUT6: CoverPage (J32.1), MOTORS (J16.4 J17.4 J20.4 J21.4), Designator/D1 (9 pins), Designator/D5 (9 pins), Designator/D4 (9 pins), Designator/D2 (9 pins), Designator/D3 (9 pins), POWER_SHEET (13 pins)
VOUT12: CoverPage (J33.1), COOLING (J13.1 J25.1), POWER_SHEET (19 pins)
ENCA_DIS: MOTORS (J21.5), GPIO_EXPANDER_A (U4.23)
ENCA_EJ: MOTORS (J17.6), GPIO_EXPANDER_A (U4.2)
ENCA_RS: MOTORS (J16.5), GPIO_EXPANDER_A (U4.5)
ENCA_WCK: MOTORS (J20.5), GPIO_EXPANDER_A (U4.27)
ENCB_DIS: MOTORS (J21.6), GPIO_EXPANDER_A (U4.24)
ENCB_EJ: MOTORS (J17.5), GPIO_EXPANDER_A (U4.1)
ENCB_RS: MOTORS (J16.6), GPIO_EXPANDER_A (U4.6)
ENCB_WCK: MOTORS (J20.6), GPIO_EXPANDER_A (U4.28)
FAN_1_PWM: MCU (MD1.11), COOLING (J13.3)
FAN_2_PWM: MCU (MD1.31), COOLING (J25.3)
HEATER_CTRL: HEATING (U1.3), MCU (MD1.24)
HTR_TMP_IN: HEATING (J3.1 R3.2), MCU (MD1.7)
INA_DIS: Designator/D2 (R21_D2.2), GPIO_EXPANDER_A (U4.22)
INA_EJ: Designator/D4 (R21_D4.2), GPIO_EXPANDER_A (U4.3)
INA_MIX: Designator/D1 (R21_D1.2), GPIO_EXPANDER_B (U9.26)
INA_RS: Designator/D5 (R21_D5.2), GPIO_EXPANDER_A (U4.8)
INA_WCK: Designator/D3 (R21_D3.2), GPIO_EXPANDER_A (U4.25)
INB_DIS: Designator/D2 (R27_D2.2), GPIO_EXPANDER_A (U4.21)
INB_EJ: Designator/D4 (R23_D4.2 R26_D4.2), GPIO_EXPANDER_A (U4.4)
INB_MIX: Designator/D1 (R27_D1.2), GPIO_EXPANDER_B (U9.25)
INB_RS: Designator/D5 (R27_D5.2), GPIO_EXPANDER_A (U4.7)
INB_WCK: Designator/D3 (R27_D3.2), GPIO_EXPANDER_A (U4.26)
LCD_BL: MCU (MD1.26), UI (J2.8)
LCD_CLK: MCU (MD1.30), UI (J2.4)
LCD_CS: MCU (MD1.29), UI (J2.5)
LCD_DC: MCU (MD1.28), UI (J2.6)
LCD_DIN: MCU (MD1.37), UI (J2.3)
LCD_RST: MCU (MD1.27), UI (J2.7)
LS_DIS: MOTORS (J19.2), GPIO_EXPANDER_B (U9.24)
LS_EJ: MOTORS (J15.2), GPIO_EXPANDER_B (U9.22)
LS_RS: MOTORS (J14.2), GPIO_EXPANDER_B (U9.21)
LS_WCK: MOTORS (J18.2), GPIO_EXPANDER_B (U9.23)
OUTA: MOTORS (J20.2), Designator/D3 (6 pins)
OUTA: MOTORS (J16.2), Designator/D5 (6 pins)
OUTA: MOTORS (J17.2), Designator/D4 (6 pins)
OUTA: MOTORS (J21.2), Designator/D2 (6 pins)
OUTA: MOTORS (J22.1), Designator/D1 (6 pins)
OUTB: MOTORS (J20.1), Designator/D3 (5 pins)
OUTB: MOTORS (J16.1), Designator/D5 (5 pins)
OUTB: MOTORS (J17.1), Designator/D4 (5 pins)
OUTB: MOTORS (J21.1), Designator/D2 (5 pins)
OUTB: MOTORS (J22.2), Designator/D1 (5 pins)
PWM_DIS: MCU (MD1.13), Designator/D2 (R23_D2.2 R26_D2.2)
PWM_EJ: MCU (MD1.16), Designator/D4 (R27_D4.2)
PWM_MIX: MCU (MD1.12), Designator/D1 (R23_D1.2 R26_D1.2)
PWM_RS: MCU (MD1.23), Designator/D5 (R23_D5.2 R26_D5.2)
PWM_WCK: MCU (MD1.14), Designator/D3 (R23_D3.2 R26_D3.2)
SCL: MCU (MD1.36 R15.1), GPIO_EXPANDER_A (U4.12), GPIO_EXPANDER_B (U9.12)
SDA: MCU (MD1.33 R16.1), GPIO_EXPANDER_A (U4.13), GPIO_EXPANDER_B (U9.13)
SOLENOID: MCU (MD1.10), SOLENOID (R7.1)
START_BUTTON: MCU (MD1.9), UI (C1.1 J1.2 R2.2)
TMP_IN_COOL: MCU (MD1.6), COOLING (J26.1 R17.2)